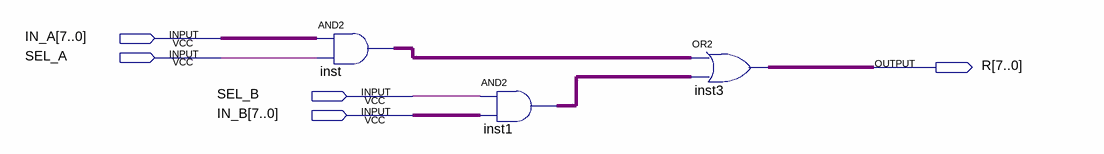
[diagram p0: schematic sheet]
// Quartus schematic SELECT.bdf as structural Verilog: 3 symbols, 5 pins
module SELECT (
  input  [7:0] IN_A,
  input  SEL_A,
  input  SEL_B,
  input  [7:0] IN_B,
  output [7:0] R
);

  wire [7:0] inst1_out, inst_out;

  assign inst_out = IN_A & {8{SEL_A}};  // AND2 inst, 8 bits wide
  assign inst1_out = {8{SEL_B}} & IN_B;  // AND2 inst1, 8 bits wide
  assign R = inst_out | inst1_out;  // OR2 inst3, 8 bits wide
endmodule
